# EAGLE design alimentazione (EAGLE 8.4.0)
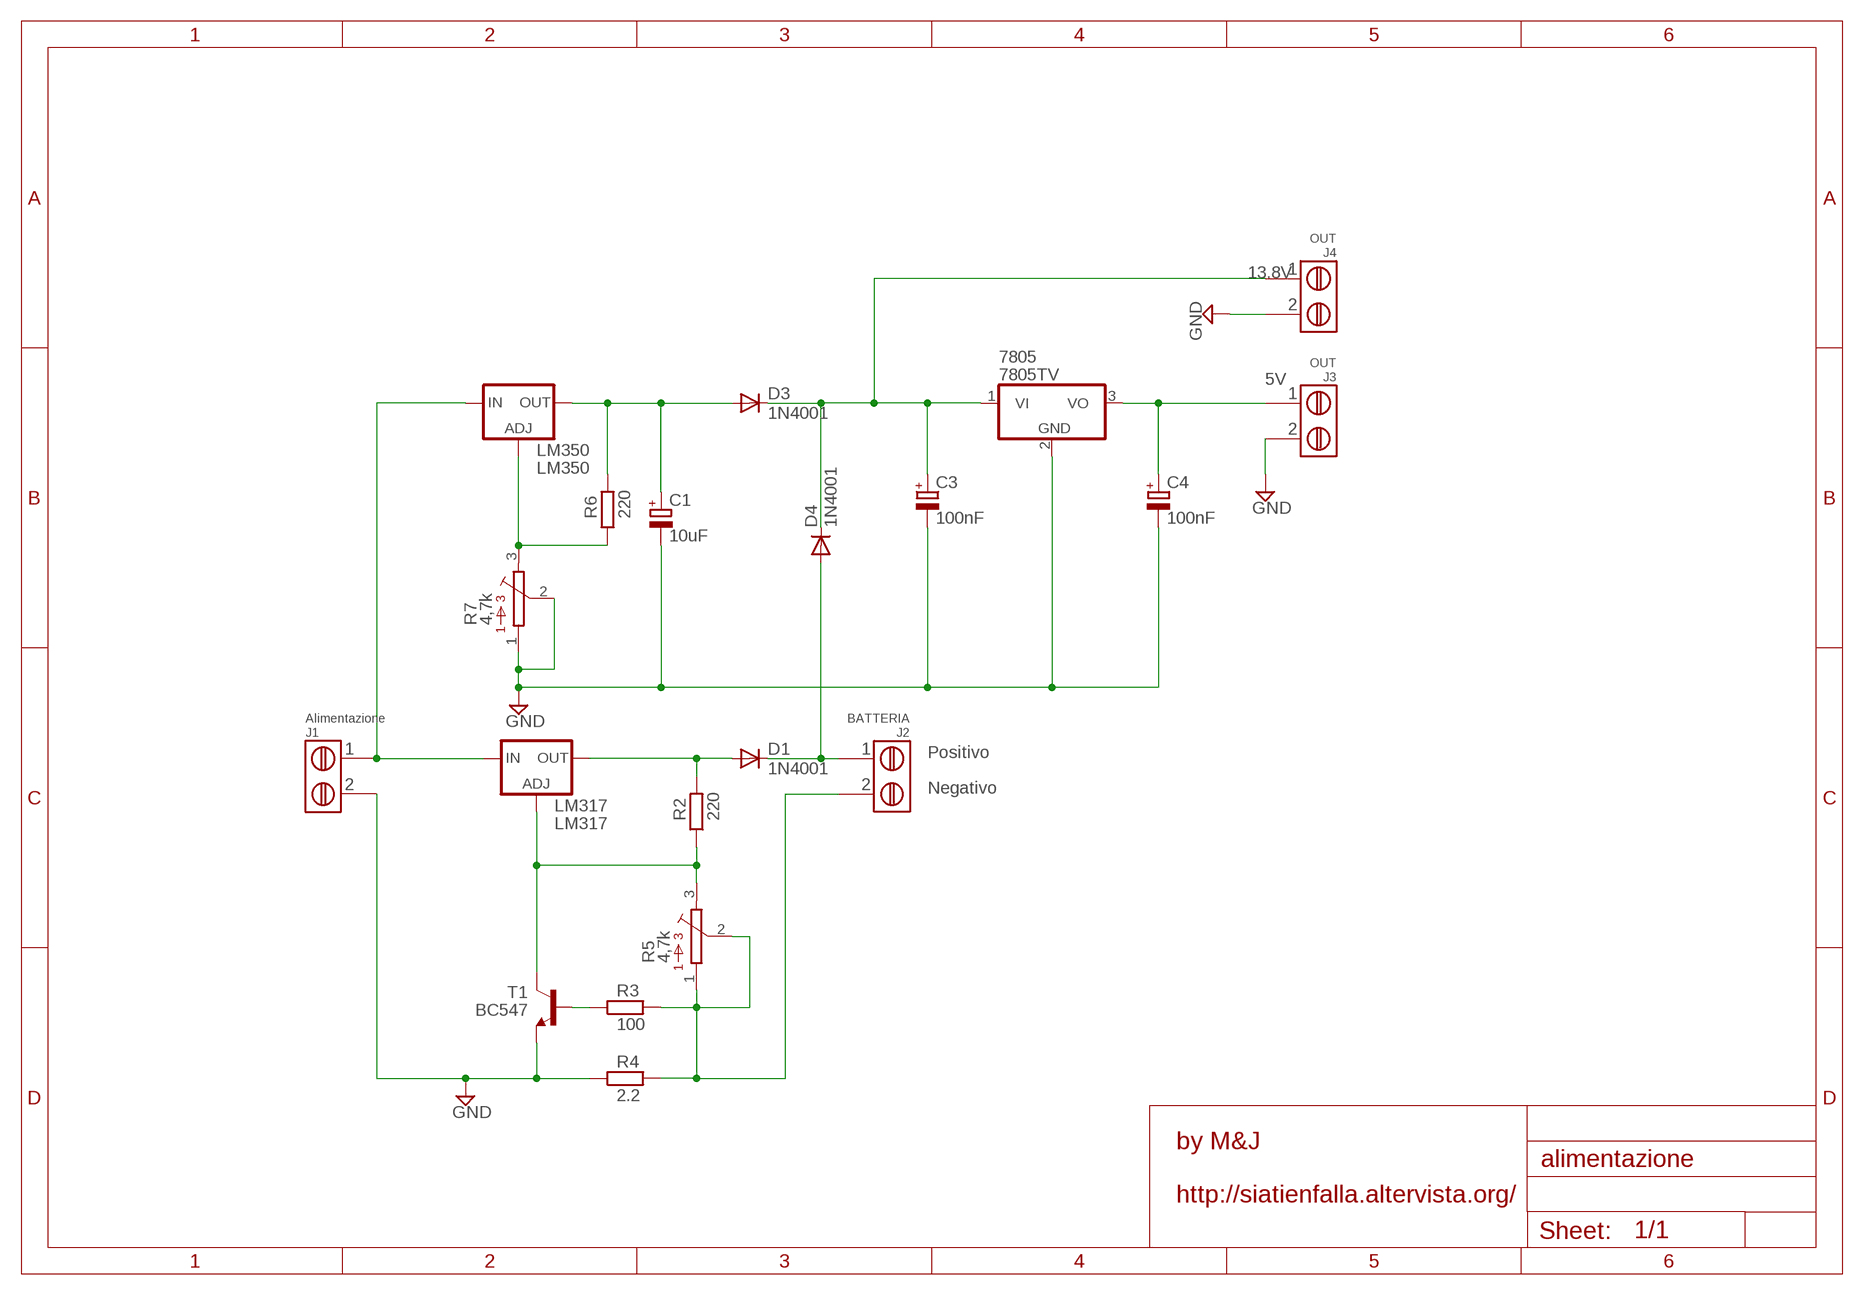
[diagram p0: schematic, sheet 1]
FRAME1 (A4L-LOC): A: by M&J

## Parts
7805  7805TV  [TO220V]
C1  10uF  CPOL-EUE2.5-6  [E2,5-6]
C3  100nF  CPOL-EUE2.5-6  [E2,5-6]
C4  100nF  CPOL-EUE2.5-6  [E2,5-6]
D1  1N4001  1N4004  [DO41-10]
D3  1N4001  1N4004  [DO41-10]
D4  1N4001  1N4004  [DO41-10]
J1  Alimentazione  MORSETTIERA  [MORSETTIERA]
J2  BATTERIA  MORSETTIERA  [MORSETTIERA]
J3  OUT  MORSETTIERA  [MORSETTIERA]
J4  OUT  MORSETTIERA  [MORSETTIERA]
LM317  LM317  LM317TS  [317TS]
LM350  LM350  LM317TS  [317TS]
R2  220  RES  [R1/4W]
R3  100  RES  [R1/4W]
R4  2.2  RES  [R1/4W]
R5  4,7k  CA9V  [CA9V]
R6  220  RES  [R1/4W]
R7  4,7k  CA9V  [CA9V]
T1  BC547  [TO92]

## Nets
5V: 7805.3(VO) C4.+ J3.1
13.8V: 7805.1(VI) C3.+ D3.C(K) D4.C(K) J4.1
+BAT: D1.C(K) D4.A J2.1
-BAT: J2.2 R3.2 R4.2 R5.1 R5.2
GND: 7805.2(GND) C1.- C3.- C4.- J1.2 J3.2 J4.2 R4.1 R7.1 R7.2 T1.1(E)
N$3: C1.+ D3.A LM350.2(OUT) R6.2
N$4: R3.1 T1.2(B)
N$5: LM350.1(ADJ) R6.1 R7.3
N$13: J1.1 LM317.3(IN) LM350.3(IN)
N$15: D1.A LM317.2(OUT) R2.2
N$27: LM317.1(ADJ) R2.1 R5.3 T1.3(C)

## Notes on the sheet
- Positivo
- Negativo

## Library data of the parts
7805 = linear:78*: Positive VOLTAGE REGULATOR Source: http://cache.national.com/ds/LM/LM78L05.pdf http://www.fairchildsemi.com/ds/LM/LM7805.pdf
C1 C3 C4 = rcl:CPOL-EU: POLARIZED CAPACITOR, European symbol
D1 D3 D4 = Libreria-componenti:1N4004: DIODO Uso generale, 1 A
J1-J4 = Libreria-componenti:MORSETTIERA: Morsettiera 2 posizioni
LM317 LM350 = v-reg:LM317TS: VOLTAGE REGULATOR
R2-R4 R6 = Libreria-componenti:RES: Resistenza
R5 R7 = pot:CA9V: POTENTIOMETER
T1 = transistor-npn:BC547: NPN TRANSISTOR

## Board
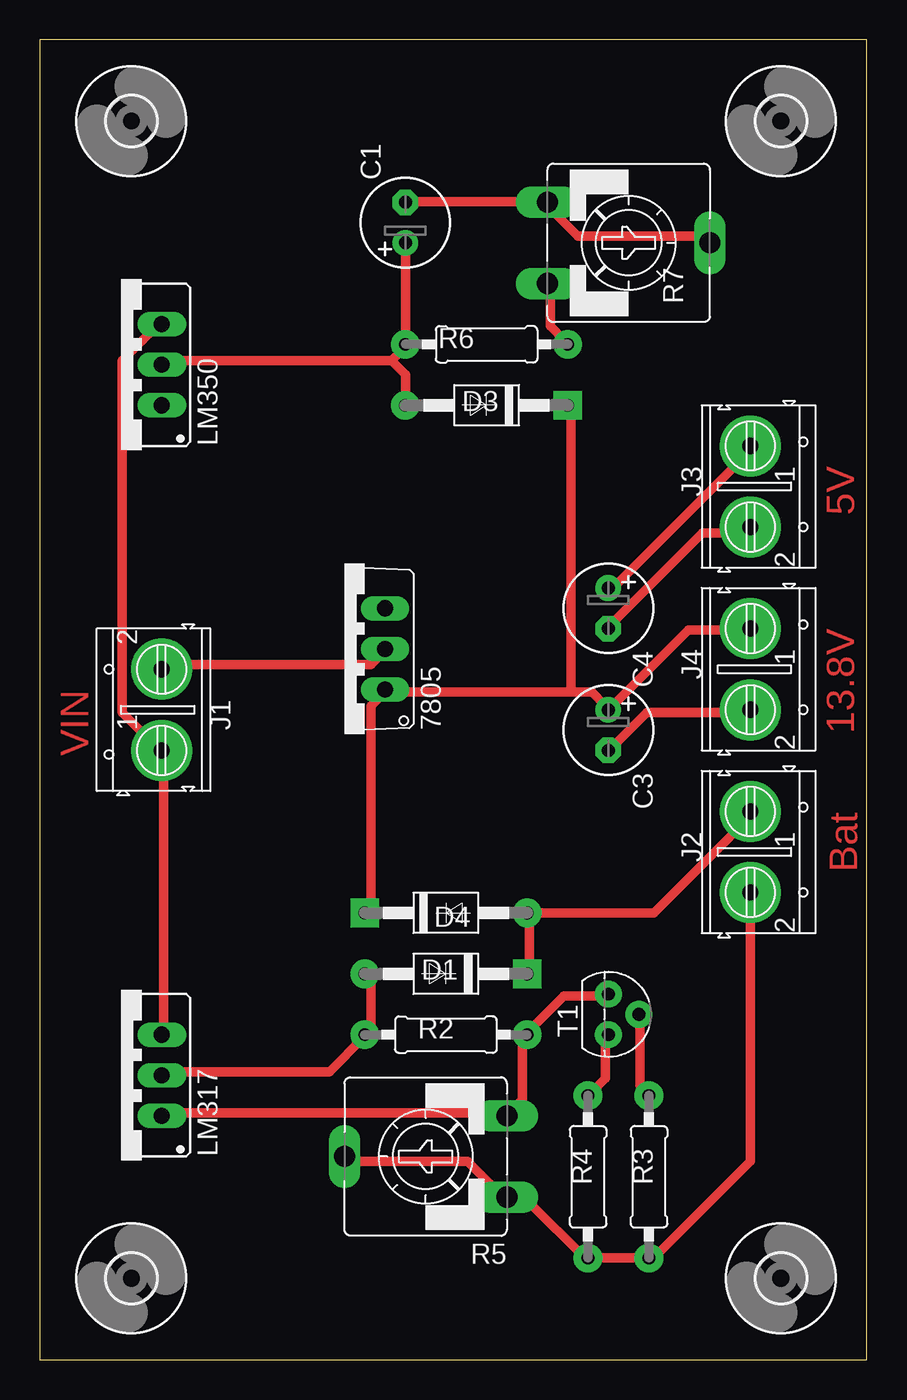
[diagram p1: board, top side]
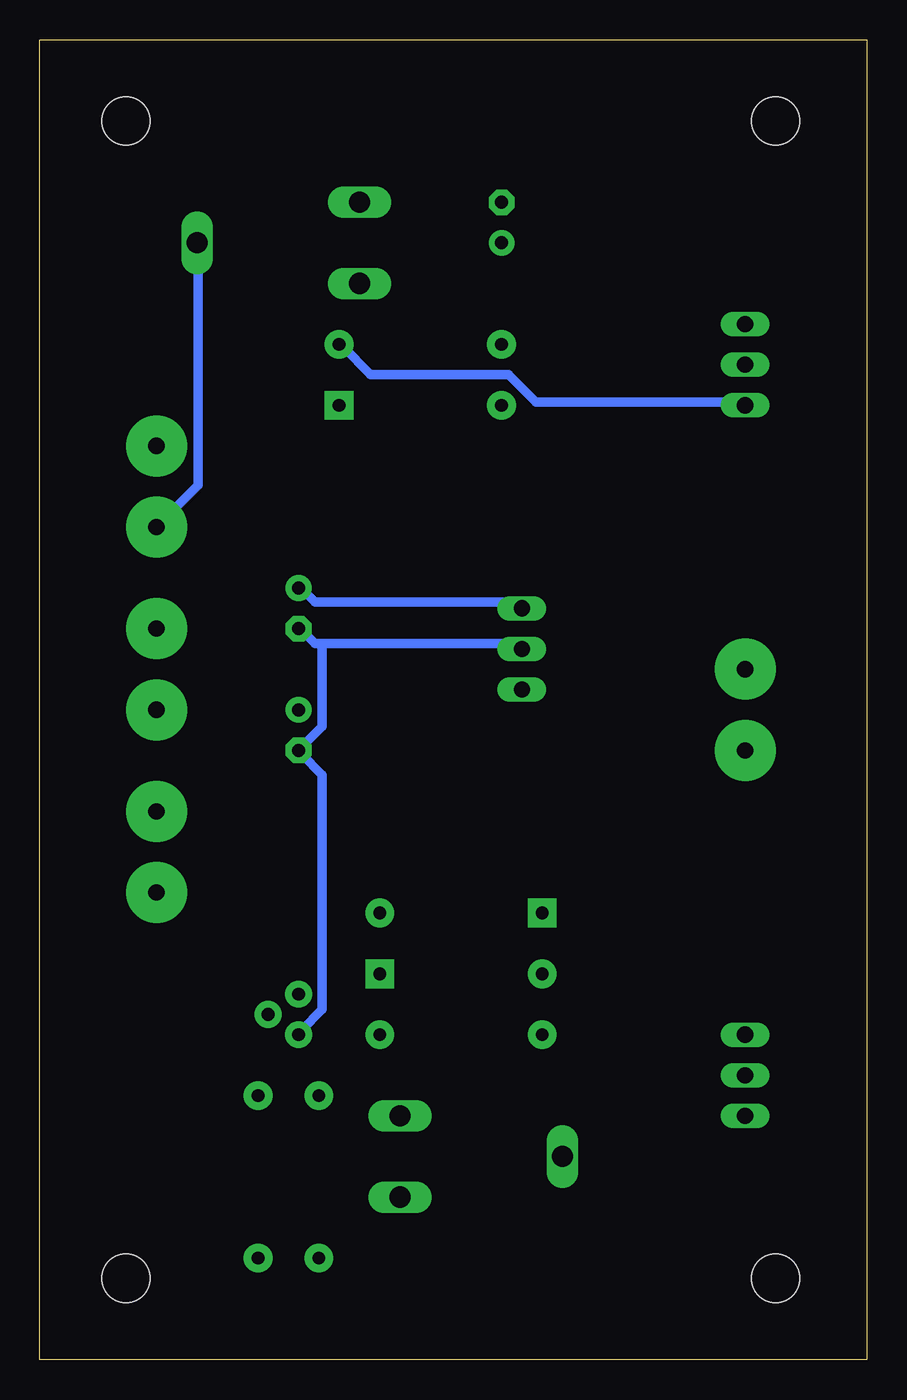
[diagram p2: board, bottom side, seen from below]

Size 51.74 x 82.54 mm. Coordinates in mm from the lower left corner, seen from the top.
Outline: 0,0 51.74,0 51.74,82.54 0,82.54 0,0
Copper layers (1*16): Top 0.035mm / dielectric 1.5mm / Bottom 0.035mm
Design rules "default *": minimum track width 24mil, minimum drill 24mil, track to track 10mil, track to pad 10mil, pad to pad 10mil, via to via 10mil, smd to smd 8mil, copper to edge 50mil, drill to drill 15mil, minimum pad ring 10mil, minimum via ring 8mil, stop-mask expansion 4mil, vias tented up to drill 0mil, thermal gap 10mil

### Footprints (pad centres in the part's own frame; a part is rotated, then mirrored left to right if it is on the bottom)
TO220V = drill 1.016 long: 1 -2.54,-2.54; 2 0,-2.54; 3 2.54,-2.54
E2,5-6 = drill 0.813 pad 1.6: + -1.27,0 | drill 0.813 pad 1.6 octagon: - 1.27,0
DO41-10 = drill 0.8 pad 1.8: A 5.08,0 | drill 0.8 pad 1.8 square: C -5.08,0
MORSETTIERA = drill 1.016 pad 3.81: 1 0,0; 2 5.08,0
317TS = drill 1.016 long: 1 -2.54,-2.54; 2 0,-2.54; 3 2.54,-2.54
R1/4W = drill 0.8 pad 1.8: 1 -5.08,0; 2 5.08,0
CA9V = drill 1.321 long: 1 -2.54,-5.08; 2 0,5.08; 3 2.54,-5.08
TO92 = drill 0.8 pad 1.676: 1 1.27,0; 2 0,1.905; 3 -1.27,0
3,0 = hole 3: 0,0

### Placement (x,y rotation side)
7805  19.05,44.45 90 top
C1  22.86,71.12 90 top
C3  35.56,39.37 270 top
C4  35.56,46.99 270 top
D1  25.4,24.13 180 top
D3  27.94,59.69 180 top
D4  25.4,27.94 0 top
J1  7.62,38.1 90 top
J2  44.45,34.29 270 top
J3  44.45,57.15 270 top
J4  44.45,45.72 270 top
LM317  5.08,17.78 90 top
LM350  5.08,62.23 90 top
R2  25.4,20.32 180 top
R3  38.1,11.43 270 top
R4  34.29,11.43 270 top
R5  24.13,12.7 90 top
R6  27.94,63.5 180 top
R7  36.83,69.85 270 top
T1  35.56,21.59 270 top
U$1  [3,0]  5.71,5.08 0 top
U$2  [3,0]  46.36,5.08 0 top
U$3  [3,0]  46.36,77.47 0 top
U$4  [3,0]  5.71,77.47 0 top

### Tracks (layer width: path | path; a pad name or v marks a point on that pad's centre or on a via)
5V
  Top 0.61: J3.1 44.45,56.87 35.81,48.23 C4.+
  Bottom 0.61: 7805.3 22,47.37 34.52,47.37 35.38,48.23 C4.+
13.8V
  Top 0.61: 33.22,41.76 34.52,41.76 35.38,40.89 C3.+ 40.56,45.64 44.45,45.64 J4.1 | 33.22,41.76 22,41.76 7805.1 21.57,41.76 20.7,40.89 20.7,27.94 D4.C | 33.22,41.76 33.22,59.46 D3.C
+BAT
  Top 0.61: 30.63,27.94 30.63,24.49 D1.C | 30.63,27.94 38.41,27.94 44.45,33.98 J2.1 | 30.63,27.94 D4.A
-BAT
  Top 0.61: R5.2 19.41,12.39 26.75,12.39 28.91,10.24 R5.1 29.34,9.8 30.63,9.8 34.09,6.35 R4.2 R3.2 38.41,6.35 44.45,12.39 J2.2
GND
  Top 0.61: C1.- 22.86,72.41 31.5,72.41 R7.1 31.93,71.98 33.66,70.26 41.86,70.26 R7.2 | T1.1 35.38,20.17 35.38,17.58 34.52,16.71 R4.1 | J1.2 7.75,43.48 20.7,43.48 21.57,44.35 7805.2 | J4.2 44.45,40.46 37.97,40.46 35.81,38.3 C3.- | J3.2 44.45,51.69 41.43,51.69 35.81,46.08 C4.-
  Bottom 0.61: 34.09,44.78 34.52,44.78 35.38,45.64 C4.- | 34.09,44.78 22,44.78 7805.2 | 34.09,44.78 34.09,39.6 35.38,38.3 C3.- 35.38,37.87 34.09,36.58 34.09,21.89 35.38,20.6 T1.1 | R7.2 41.86,69.83 41.86,54.71 44.45,52.12 J3.2
N$3
  Top 0.61: 22,62.48 7.75,62.48 LM350.2 | 22,62.48 22.86,63.35 R6.2 C1.+ | D3.A 22.86,61.62 22,62.48
N$4
  Top 0.61: T1.2 37.54,21.46 37.54,17.14 37.97,16.71 R3.1
N$5
  Top 0.61: R7.3 31.93,67.23 31.93,64.64 32.79,63.78 R6.1
  Bottom 0.61: LM350.1 7.75,59.89 20.7,59.89 22.43,61.62 31.06,61.62 32.79,63.35 R6.1
N$13
  Top 0.61: LM317.3 7.75,20.6 7.75,37.87 J1.1 7.31,38.3 5.16,40.46 5.16,62.48 7.31,64.64 LM350.3
N$15
  Top 0.61: LM317.2 7.75,18.01 18.11,18.01 20.27,20.17 R2.2 20.7,20.6 20.7,24.05 D1.A
N$27
  Top 0.61: T1.3 35.38,22.76 32.79,22.76 30.63,20.6 R2.1 30.2,20.17 30.2,16.28 29.34,15.42 R5.3 28.91,15.42 7.75,15.42 LM317.1

### Text on the board
Top: 5V | 13.8V | VIN | Bat